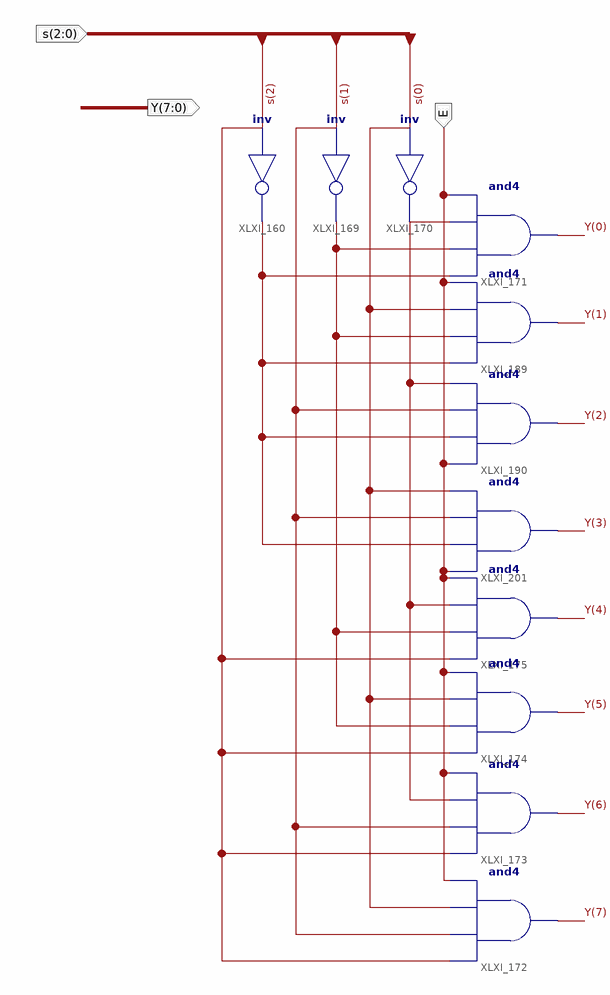
[diagram p0: schematic sheet 1]
// Xilinx ISE schematic decoder3to8.sch (spartan6) as structural Verilog: 11 symbols, 3 ports
module decoder3to8 (
  input  E,
  input  [2:0] s,
  output [7:0] Y
);

  wire XLXN_103, XLXN_104, XLXN_132;

  not XLXI_169 (XLXN_103, s[1]);
  not XLXI_160 (XLXN_132, s[2]);
  not XLXI_170 (XLXN_104, s[0]);
  and XLXI_171 (Y[0], XLXN_132, XLXN_103, XLXN_104, E);
  and XLXI_189 (Y[1], XLXN_132, XLXN_103, s[0], E);
  and XLXI_190 (Y[2], E, XLXN_132, s[1], XLXN_104);
  and XLXI_173 (Y[6], s[2], s[1], XLXN_104, E);
  and XLXI_172 (Y[7], s[2], s[1], s[0], E);
  and XLXI_175 (Y[4], s[2], XLXN_103, XLXN_104, E);
  and XLXI_174 (Y[5], s[2], XLXN_103, s[0], E);
  and XLXI_201 (Y[3], E, XLXN_132, s[1], s[0]);
endmodule
